# Altium schematic sheet FuelGauge.SchDoc
size A
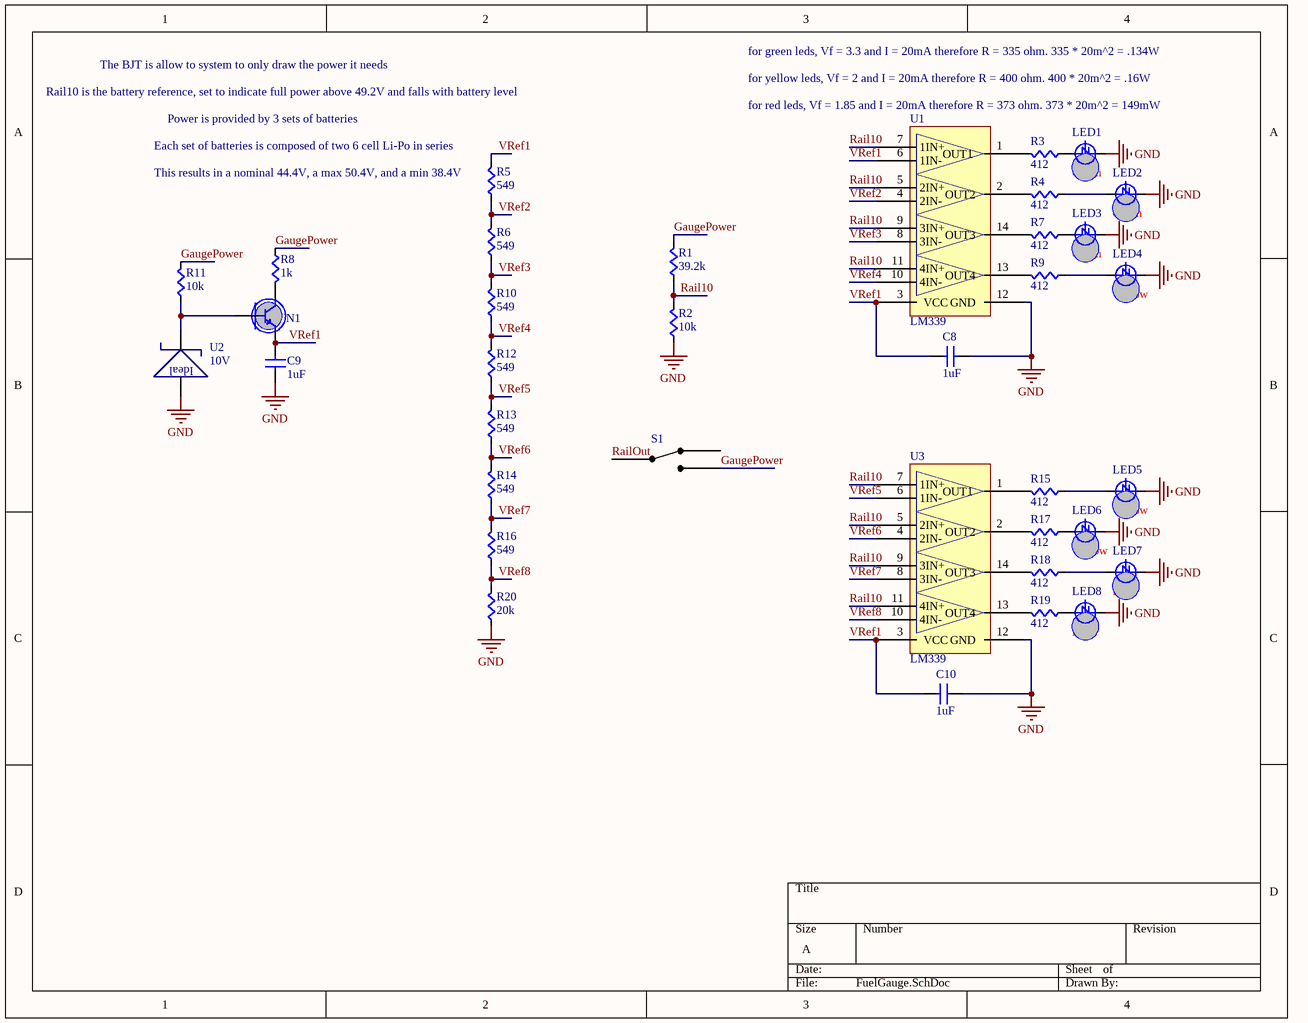
[diagram p0: FuelGauge.SchDoc]

## Parts
C8  value 1uF  [CAPC0603]  (hidden comment: Cap)
C9  value 1uF  [CAPC0603]  (hidden comment: Cap)
C10  value 1uF  [CAPC0603]  (hidden comment: Cap)
LED1  Color: Green  [LED0603]  (hidden comment: LED)
LED2  Color: Green  [LED0603]  (hidden comment: LED)
LED3  Color: Green  [LED0603]  (hidden comment: LED)
LED4  Color: Yellow  [LED0603]  (hidden comment: LED)
LED5  Color: Yellow  [LED0603]  (hidden comment: LED)
LED6  Color: Yellow  [LED0603]  (hidden comment: LED)
LED7  Color: Red  [LED0603]  (hidden comment: LED)
LED8  Color: Red  [LED0603]  (hidden comment: LED)
N1  NPNBJT  [PZT3904]  (value not drawn)
R1  value 39.2k  [RES0603]  (hidden comment: Res)
R2  value 10k  [RES0603]  (hidden comment: Res)
R3  value 412  [RES1206]  (hidden comment: Res)
R4  value 412  [RES1206]  (hidden comment: Res)
R5  value 549  [RES0603]  (hidden comment: Res)
R6  value 549  [RES0603]  (hidden comment: Res)
R7  value 412  [RES1206]  (hidden comment: Res)
R8  value 1k  [RES1206]  (hidden comment: Res)
R9  value 412  [RES1206]  (hidden comment: Res)
R10  value 549  [RES0603]  (hidden comment: Res)
R11  value 10k  [RES0603]  (hidden comment: Res)
R12  value 549  [RES0603]  (hidden comment: Res)
R13  value 549  [RES0603]  (hidden comment: Res)
R14  value 549  [RES0603]  (hidden comment: Res)
R15  value 412  [RES1206]  (hidden comment: Res)
R16  value 549  [RES0603]  (hidden comment: Res)
R17  value 412  [RES1206]  (hidden comment: Res)
R18  value 412  [RES1206]  (hidden comment: Res)
R19  value 412  [RES1206]  (hidden comment: Res)
R20  value 20k  [RES0603]  (hidden comment: Res)
S1  SPDT Slide Switch  [CL-SB-12B-01T]  (value not drawn)
U1  LM339  [LM339]
U2  Reverse Breakdown Voltage: 10V  [LM4040]  (hidden comment: LM4040)
U3  LM339  [LM339]

## Nets
GND: C8.2(B) C9.2(B) C10.2(B) LED1.C LED2.C LED3.C LED4.C LED5.C LED6.C LED7.C LED8.C R2.2(B) R20.2(B) U1.12(GND) U2.2(Cathode) U3.12(GND)
GaugePower: R1.1(A) R8.2(B) R11.1(A) S1.3
Rail10: R1.2(B) R2.1(A) U1.5(2IN+) U1.7(1IN+) U1.9(3IN+) U1.11(4IN+) U3.5(2IN+) U3.7(1IN+) U3.9(3IN+) U3.11(4IN+)
RailOut: S1.2
VRef1: C8.1(A) C9.1(A) C10.1(A) N1.E R5.1(A) U1.3(VCC) U1.6(1IN-) U3.3(VCC)
VRef2: R5.2(B) R6.1(A) U1.4(2IN-)
VRef3: R6.2(B) R10.1(A) U1.8(3IN-)
VRef4: R10.2(B) R12.1(A) U1.10(4IN-)
VRef5: R12.2(B) R13.1(A) U3.6(1IN-)
VRef6: R13.2(B) R14.1(A) U3.4(2IN-)
VRef7: R14.2(B) R16.1(A) U3.8(3IN-)
VRef8: R16.2(B) R20.1(A) U3.10(4IN-)
NetLED1_A: LED1.A R3.2(B)
NetLED2_A: LED2.A R4.2(B)
NetLED3_A: LED3.A R7.2(B)
NetLED4_A: LED4.A R9.2(B)
NetLED5_A: LED5.A R15.2(B)
NetLED6_A: LED6.A R17.2(B)
NetLED7_A: LED7.A R18.2(B)
NetLED8_A: LED8.A R19.2(B)
NetN1_B: N1.B R11.2(B) U2.1(Anode)
NetN1_C: N1.C R8.1(A)
NetR3_1: R3.1(A) U1.1(OUT1)
NetR4_1: R4.1(A) U1.2(OUT2)
NetR7_1: R7.1(A) U1.14(OUT3)
NetR9_1: R9.1(A) U1.13(OUT4)
NetR15_1: R15.1(A) U3.1(OUT1)
NetR17_1: R17.1(A) U3.2(OUT2)
NetR18_1: R18.1(A) U3.14(OUT3)
NetR19_1: R19.1(A) U3.13(OUT4)

Not connected (* = marked no-connect by the designer): S1 1

## Notes on the sheet
- Rail10 is the battery reference, set to indicate full power above 49.2V and falls with battery level
- The BJT is allow to system to only draw the power it needs
- for green leds, Vf = 3.3 and I = 20mA therefore R = 335 ohm. 335 * 20m^2 = .134W
- for yellow leds, Vf = 2 and I = 20mA therefore R = 400 ohm. 400 * 20m^2 = .16W
- (near R5) Each set of batteries is composed of two 6 cell Li-Po in series
- Power is provided by 3 sets of batteries
- for red leds, Vf = 1.85 and I = 20mA therefore R = 373 ohm. 373 * 20m^2 = 149mW
- (near R5) This results in a nominal 44.4V, a max 50.4V, and a min 38.4V
- (in symbol LM4040) Ideal

## Library data of the parts
N1 = NPNBJT: NPN Transistor Template; Supplier 1: Digi-Key; Supplier Part Number 1: PZT3904CT-ND
U1 U3 = LM339: IC QUAD DIFF COMPARATOR 14-TSSOP; Supplier 1: Digi-Key; Supplier Part Number 1: 296-18454-1-ND
U2 = LM4040: LM4040AIM3-10.0/NOPBCT; Supplier 1: Digi-Key; Supplier Part Number 1: LM4040AIM3-10.0/NOPBCT-ND
C8-C10 = Cap: Supplier 1: Digi-Key; Supplier Part Number 1: 1276-1946-1-ND
LED1-LED8 = LED: Supplier 1: Digi-Key
  LED1-LED3: Supplier Part Number 1: 754-1126-1-ND
  LED4-LED6: Supplier Part Number 1: 754-1124-1-ND
  LED7 LED8: Supplier Part Number 1: 754-1122-1-ND
R1-R20 = Res: Supplier 1: Digi-Key
  R1: Supplier Part Number 1: RNCP0603FTD39K2CT-ND
  R2 R11: Supplier Part Number 1: RMCF0603JT10K0CT-ND
  R3 R4 R7 R9 R15 R17-R19: Supplier Part Number 1: P412FCT-ND
  R5 R6 R10 R12-R14 R16: Supplier Part Number 1: P549HCT-ND
  R8: Supplier Part Number 1: RNCP1206FTD1K00CT-ND
  R20: Supplier Part Number 1: P20.0KHCT-ND
S1 = SPDT Slide Switch: Supplier 1: Digi-Key; Supplier Part Number 1: 563-1318-1-ND